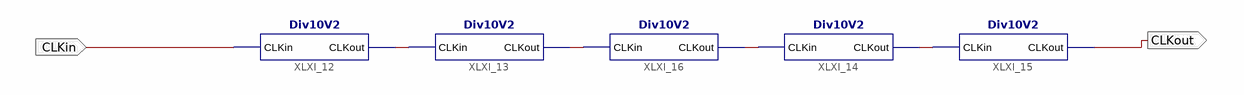
[diagram p0: schematic sheet 1]
// Xilinx ISE schematic Div100K.sch (spartan6) as structural Verilog: 5 symbols, 2 ports
module Div100K (
  input  CLKin,
  output CLKout
);

  wire XLXN_19, XLXN_20, XLXN_21, XLXN_22;

  Div10V2 XLXI_12 (.CLKin(CLKin), .CLKout(XLXN_19));
  Div10V2 XLXI_13 (.CLKin(XLXN_19), .CLKout(XLXN_20));
  Div10V2 XLXI_14 (.CLKin(XLXN_21), .CLKout(XLXN_22));
  Div10V2 XLXI_15 (.CLKin(XLXN_22), .CLKout(CLKout));
  Div10V2 XLXI_16 (.CLKin(XLXN_20), .CLKout(XLXN_21));
endmodule
